# EAGLE design rc1180 (EAGLE 9.6.2)
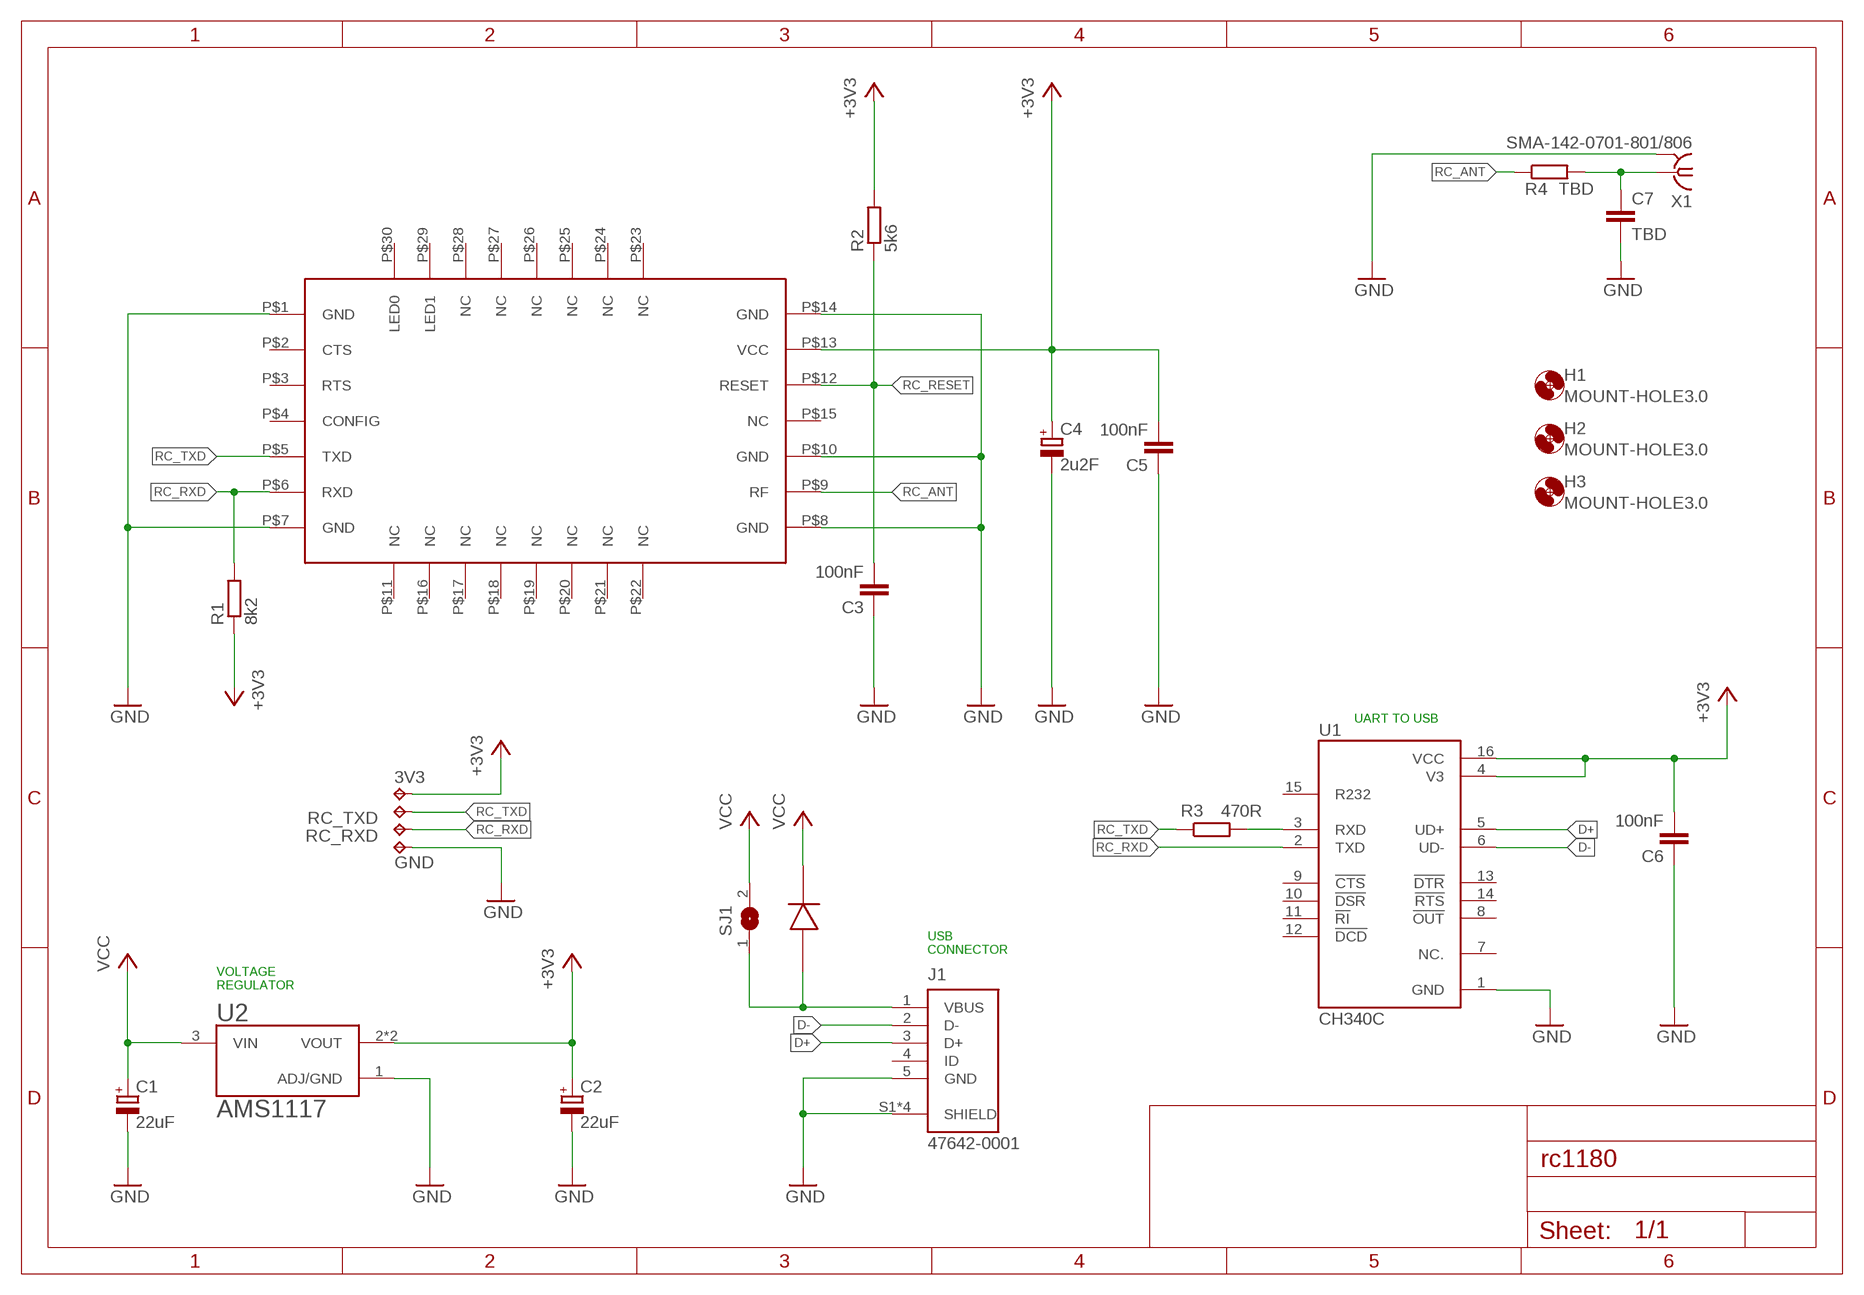
[diagram p0: schematic, sheet 1]

## Parts
3V3  TPB1,27  [B1,27]
C1  22uF  CPOL-EUC/6032-28R  [C/6032-28R]
C2  22uF  CPOL-EUC/6032-28R  [C/6032-28R]
C3  100nF  C-EUC0805K  [C0805K]
C4  2u2F  CPOL-EUA/3216-18W  [A/3216-18W]
C5  100nF  C-EUC0805K  [C0805K]
C6  100nF  C-EUC0805K  [C0805K]
C7  TBD  C-EUC0603  [C0603]
GND  TPB1,27  [B1,27]
H1  MOUNT-HOLE3.0  [3,0]
H2  MOUNT-HOLE3.0  [3,0]
H3  MOUNT-HOLE3.0  [3,0]
J1  47642-0001  [MOLEX_47642-0001]
R1  8k2  R-EU_R0805  [R0805]
R2  5k6  R-EU_R0805  [R0805]
R3  470R  R-EU_R0805  [R0805]
R4  TBD  R-EU_R0603  [R0603]
RC_RXD  TPB1,27  [B1,27]
RC_TXD  TPB1,27  [B1,27]
SJ1  SJ  [SJ]
U1  CH340C  [SOIC127P600X180-16N]
U2  AMS1117  [SOT229P700X180-4N]
U$1  RC1180-MBUS3  [RC1180-MBUS3]
U$2  MBR0540  [SOD123]
X1  SMA-142-0701-801/806  [J502-ND-142-0701-801/806]

## Nets
+3V3: 3V3.TP C2.+ C4.+ C5.2 C6.2 R1.1 R2.2 U1.4(V3) U1.16(VCC) U2.2(VOUT) U2.4(VOUT) U$1.P$13(VCC)
D+: J1.3(D+) U1.5(UD+)
D-: J1.2(D-) U1.6(UD-)
GND: C1.- C2.- C3.1 C4.- C5.1 C6.1 C7.2 GND.TP J1.5(GND) J1.S1(SHIELD) J1.S2(SHIELD) J1.S3(SHIELD) J1.S4(SHIELD) U1.1(GND) U2.1(ADJ/GND) U$1.P$1(GND) U$1.P$7(GND) U$1.P$8(GND) U$1.P$10(GND) U$1.P$14(GND) X1.G@1 X1.G@2 X1.G@3 X1.G@4
N$1: R3.2 U1.3(RXD)
N$2: J1.1(VBUS) SJ1.1 U$2.A
N$3: C7.1 R4.2 X1.1
RC_ANT: R4.1 U$1.P$9(RF)
RC_RESET: C3.2 R2.1 U$1.P$12(RESET)
RC_RXD: R1.2 RC_RXD.TP U1.2(TXD) U$1.P$6(RXD)
RC_TXD: R3.1 RC_TXD.TP U$1.P$5(TXD)
VCC: C1.+ SJ1.2 U2.3(VIN) U$2.C(K)
Unconnected: J1.4(ID) U1.7(NC.) U1.8(!OUT) U1.9(!CTS) U1.10(!DSR) U1.11(!RI) U1.12(!DCD) U1.13(!DTR) U1.14(!RTS) U1.15(R232) U$1.P$2(CTS) U$1.P$3(RTS) U$1.P$4(CONFIG) U$1.P$11(NC) U$1.P$15(NC) U$1.P$16(NC) U$1.P$17(NC) U$1.P$18(NC) U$1.P$19(NC) U$1.P$20(NC) U$1.P$21(NC) U$1.P$22(NC) U$1.P$23(NC) U$1.P$24(NC) U$1.P$25(NC) U$1.P$26(NC) U$1.P$27(NC) U$1.P$28(NC) U$1.P$29(LED1) U$1.P$30(LED0)

## Notes on the sheet
- UART TO USB
- USB 
  CONNECTOR
- VOLTAGE
  REGULATOR

## Library data of the parts
3V3 GND RC_RXD RC_TXD = testpad:TP: Test pad
C1 C2 = rcl:CPOL-EU: POLARIZED CAPACITOR, European symbol; SPICEPREFIX: C; TME_PN: 293D226X9010C2TE3
C3 C5-C7 = rcl:C-EU: CAPACITOR, European symbol; SPICEPREFIX: C
C4 = rcl:CPOL-EU: POLARIZED CAPACITOR, European symbol; SPICEPREFIX: C; TME_PN: T491A225K020AT
H1-H3 = holes:MOUNT-HOLE: MOUNTING HOLE with drill center marker
J1 = 47642-0001:47642-0001: Micro-USB B Receptacle, Mid-Mount, with Through Hole Solder Tab, Gold (Au) Flash Plating, without Mylar, Lead-Free; AVAILABILITY: Unavailable; DESCRIPTION: USB - micro B Receptacle Connector 5 Position Board Edge, Cutout; Surface Mount, Right Angle; MF: Molex; MP: 47642-0001; PACKAGE: None; PRICE: None
R1-R4 = rcl:R-EU_: RESISTOR, European symbol; SPICEPREFIX: R
SJ1 = jumper:SJ: SMD solder JUMPER
U1 = CH340C:CH340C: USB to serial chip CH340; MANUFACTURER: WCH; MAXIMUM_PACKAGE_HEIGHT: 1.8 mm; PARTREV: 2G; STANDARD: IPC 7351B
U2 = AMS1117:AMS1117: Sot223/Pkg 1-Amp 5-Volt Low Drop Out Voltage Regulatator; MANUFACTURER: AMS; MAXIMUM_PACKAGE_HEIGHT: 1.8mm; PARTREV: N/A; STANDARD: IPC-7351B
U$1 = jacek27:RC1180-MBUS3
U$2 = MBR0540:MBR0540; TME_PN: MBR0540-TP
X1 = con-coax:SMA-: SMA 50 Ohm End Launch Jack Receptacle - Round Contact Johnson Components Source: www.johnsoncomponents.com .. J502-ND.pdf; MF: JOHNSON COMPONENTS; MPN: 142-0701-801; OC_FARNELL: 1608592; OC_NEWARK: 90F2624

## Board
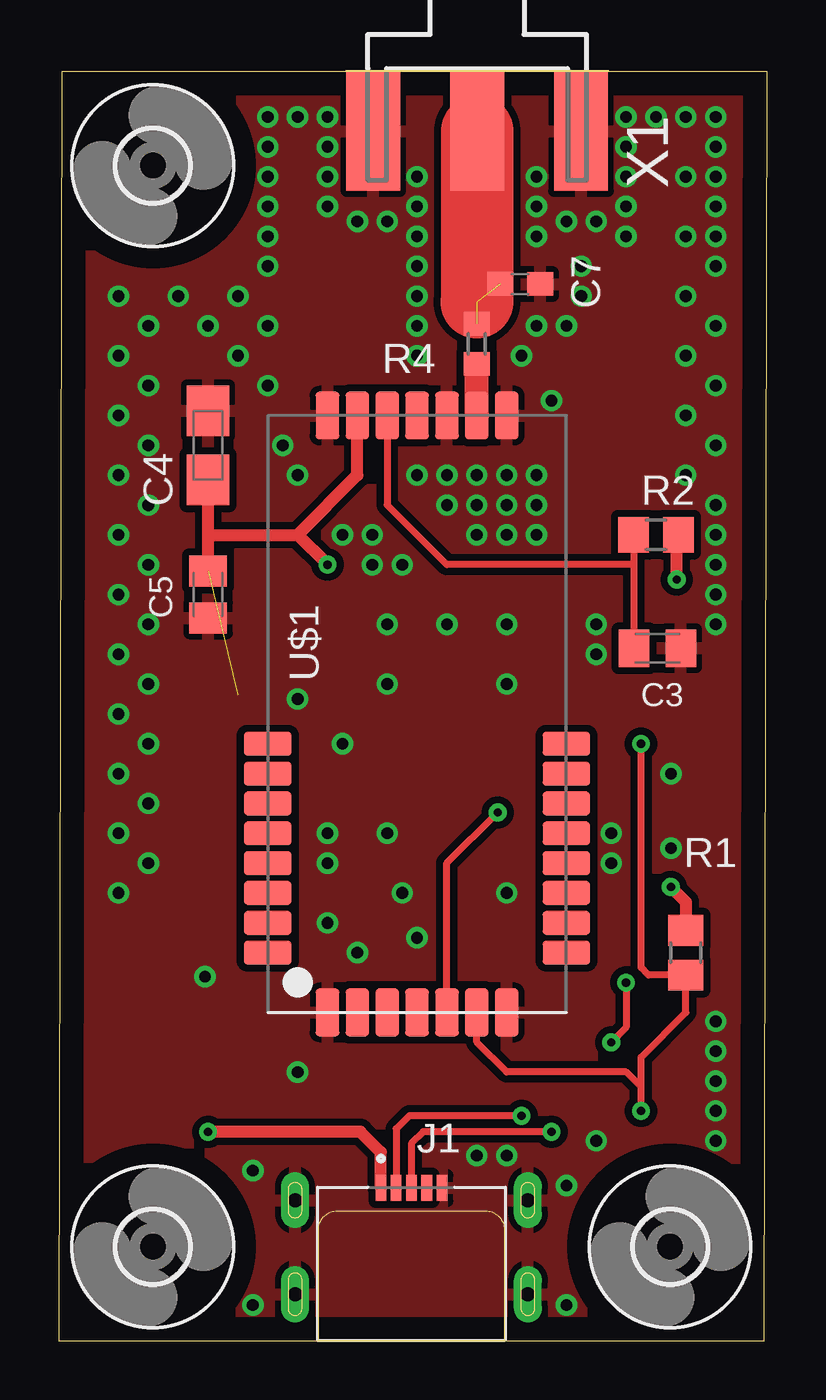
[diagram p1: board, top side]
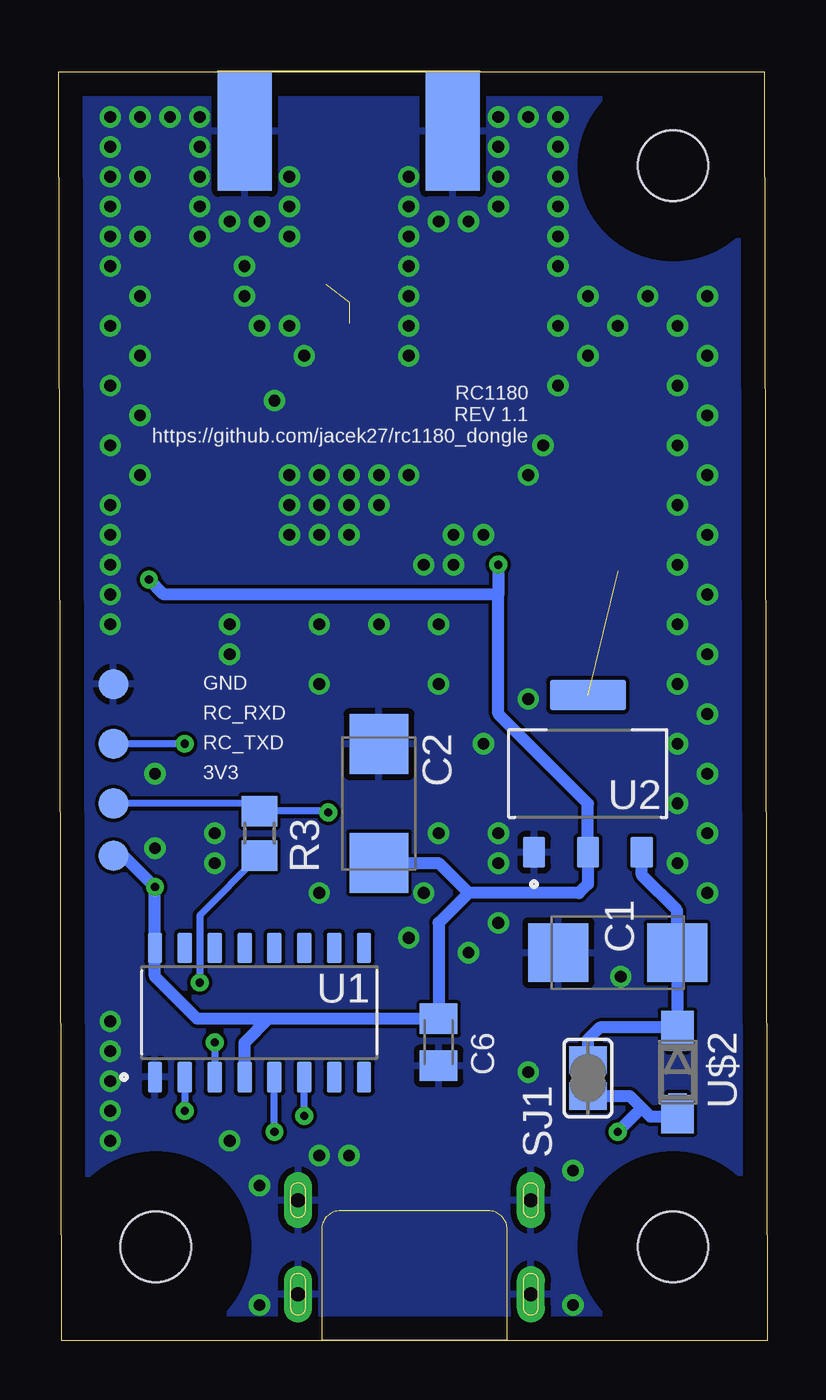
[diagram p2: board, bottom side, seen from below]

Size 30.13 x 54.03 mm. Coordinates in mm from the lower left corner, seen from the top.
Outline: 0,0 30,0 30.13,54 0.13,54 0,0
Copper layers (1*16): Top 0.035mm / dielectric 1.5mm / Bottom 0.035mm
Design rules "default": minimum track width 6mil, minimum drill 0.35mm, track to track 6mil, track to pad 6mil, pad to pad 6mil, via to via 6mil, smd to smd 6mil, copper to edge 40mil, drill to drill 6mil, minimum pad ring 10mil, minimum via ring 8mil, stop-mask expansion 4mil, vias tented up to drill 0mil, thermal gap 10mil

### Footprints (pad centres in the part's own frame; a part is rotated, then mirrored left to right if it is on the bottom)
B1,27 = smd 1.27 x 1.27: TP 0,0
C/6032-28R = smd 2.55 x 2.5: + 2.525,0; - -2.525,0
C0805K = smd 1.3 x 1.6: 1 -1,0; 2 1,0
A/3216-18W = smd 2.15 x 1.8: + 1.475,0; - -1.475,0
C0603 = smd 1.1 x 1: 1 -0.85,0; 2 0.85,0
3,0 = hole 3: 0,0
MOLEX_47642-0001 = smd 0.45 x 1.1: 1 -1.3,0; 2 -0.65,0; 3 0,0; 4 0.65,0; 5 1.3,0 | drill 0.6 pad 1.2 long: S1 -4.95,-0.52; S2 -4.95,-4.52; S3 4.95,-4.52; S4 4.95,-0.52
R0805 = smd 1.3 x 1.5: 1 -0.95,0; 2 0.95,0
R0603 = smd 1 x 1.1: 1 -0.85,0; 2 0.85,0
SJ = smd 1.168 x 1.6: 1 -0.762,0; 2 0.762,0
SOIC127P600X180-16N = smd 1.31 x 0.62: 1 -2.75,4.445; 2 -2.75,3.175; 3 -2.75,1.905; 4 -2.75,0.635; 5 -2.75,-0.635; 6 -2.75,-1.905; 7 -2.75,-3.175; 8 -2.75,-4.445; 9 2.75,-4.445; 10 2.75,-3.175; 11 2.75,-1.905; 12 2.75,-0.635; 13 2.75,0.635; 14 2.75,1.905; 15 2.75,3.175; 16 2.75,4.445
SOT229P700X180-4N = smd 1.31 x 0.93: 1 -3.345,2.29; 2 -3.345,0; 3 -3.345,-2.29 | smd 1.31 x 3.24: 4 3.345,0
RC1180-MBUS3 = smd 2.032 x 1.016: P$1 0,10.16; P$2 0,8.89; P$3 0,7.62; P$4 0,6.35; P$5 0,5.08; P$6 0,3.81; P$7 0,2.54; P$8 25.4,2.54; P$9 25.4,3.81; P$10 25.4,5.08; P$11 25.4,6.35; P$12 25.4,7.62; P$13 25.4,8.89; P$14 25.4,10.16 | smd 1.016 x 2.032: P$15 2.54,0; P$16 3.81,0; P$17 5.08,0; P$18 6.35,0; P$19 7.62,0; P$20 8.89,0; P$21 10.16,0; P$22 11.43,0; P$23 11.43,12.7; P$24 10.16,12.7; P$25 8.89,12.7; P$26 7.62,12.7; P$27 6.35,12.7; P$28 5.08,12.7; P$29 3.81,12.7; P$30 2.54,12.7
SOD123 = smd 1.6 x 0.8: 1 -1.7,0; 2 1.7,0 | smd 1.4 x 1.4: A 1.9,0; C -1.9,0
J502-ND-142-0701-801/806 = smd 5.08 x 2.286: 1 2.565,0; G@1 2.565,4.42; G@2 2.565,-4.42 | smd 5.08 x 2.286 bottom: G@3 2.565,4.42; G@4 2.565,-4.42

### Placement (x,y rotation side)
3V3  27.8,20.64 0 bottom
C1  6.35,16.51 0 bottom
C2  16.51,22.86 270 bottom
C3  25.46,29.46 180 top
C4  6.35,38.1 270 top
C5  6.35,31.75 90 top
C6  13.97,12.7 90 bottom
C7  19.62,44.96 0 top
GND  27.8,27.94 0 bottom
H1  26,4 0 top
H2  4,4 0 top
H3  4,50 0 top
J1  15,6.5 0 top
R1  26.67,16.51 270 top
R2  25.4,34.29 0 top
R3  21.59,21.59 270 bottom
R4  17.78,42.42 90 top
RC_RXD  27.8,25.4 0 bottom
RC_TXD  27.8,22.86 0 bottom
SJ1  7.62,11.18 90 bottom
U1  21.59,13.97 90 bottom
U2  7.62,24.13 90 bottom
U$1  21.59,13.97 90 top
U$2  3.81,11.43 270 bottom
X1  17.79,54.03 270 top

### Tracks (layer width: path | path; a pad name or v marks a point on that pad's centre or on a via)
+3V3  (via drill 0.35)  (1 unrouted)
  Top 0.508: C5.2 6.35,34.29 | 6.35,34.29 C4.+ | 10.16,34.29 12.7,36.83 U$1.P$13 | 6.35,34.29 10.16,34.29 | v11.43,33.02 10.16,34.29 | v26.29,32.38 26.29,34.23 R2.2 | v26.04,19.3 26.67,18.67 R1.1
  Bottom 0.508: 21.21,13.7 C6.2 13.97,17.78 12.7,19.05 | 21.21,13.7 24.24,13.7 26.04,15.49 U1.16 v26.04,19.3 27.37,20.64 3V3.TP | U1.4 22.23,12.68 21.21,13.7 | 12.7,19.05 8,19.05 7.62,19.43 U2.2 7.62,22.86 11.43,26.67 11.43,31.75 | C2.+ 16.5,20.32 13.97,20.32 12.7,19.05 | v11.43,33.02 11.43,31.75 | 11.43,31.75 25.65,31.75 v26.29,32.38
D+  (via drill 0.35)
  Top 0.305: v20.95,8.89 15.49,8.89 15,8.4 J1.3
  Bottom 0.305: v20.95,8.89 U1.5
D-  (via drill 0.35)
  Top 0.305: v19.68,9.57 14.91,9.57 14.35,9.02 J1.2
  Bottom 0.305: v19.68,9.57 U1.6
GND  (via drill 0.5)
  other vias: 13.97,27.94 19.05,27.94 2.54,24.13 2.54,26.67 2.54,29.21 2.54,31.75 2.54,21.59 2.54,19.05 10.16,11.43 6.22,15.49 22.86,8.51 27.94,8.51 27.94,9.78 27.94,11.05 27.94,12.32 27.94,13.59 16.51,30.48 13.97,30.48 19.05,30.48 27.94,30.48 27.94,31.75 27.94,33.02 27.94,34.29 27.94,35.56 8.89,48.26 8.89,46.99 8.89,45.72 8.89,43.18 10.16,36.83 8.89,40.64 20.32,36.83 20.32,35.56 17.78,36.83 17.78,35.56 19.05,34.29 19.05,19.05 8.89,49.53 10.16,52.07 11.43,50.8 12.7,47.62 15.24,48.26 15.24,46.99 15.24,45.72 15.24,44.45 15.24,43.18 15.24,41.91 20.32,48.26 20.32,46.99 20.32,49.53 15.24,49.53 13.97,47.62 11.43,48.26 11.43,49.53 11.43,52.07 8.89,52.07 8.89,50.8 21.59,47.62 22.86,47.62 24.13,46.99 24.13,48.26 24.13,49.53 24.13,50.8 24.13,52.07 25.4,52.07 26.67,52.07 27.94,52.07 27.94,50.8 27.94,49.53 27.94,48.26 27.94,46.99 20.32,43.18 21.59,43.18 22.23,44.45 22.23,45.72 19.68,41.91 20.95,40.01 27.94,45.72 27.94,43.18 27.94,40.64 27.94,38.1 26.04,20.95 26.04,24.13 23.5,21.59 22.86,29.21 22.86,30.48 23.5,20.32 21.59,1.52 8.26,1.52 8.26,7.24 17.78,7.87 19.05,7.87 21.59,6.6 11.43,20.32 13.97,21.59 12.7,16.51 11.43,17.78 14.61,19.05 15.24,17.14 11.43,21.59 12.06,25.4 10.16,27.3 16.51,36.83 19.05,36.83 16.51,35.56 19.05,35.56 17.78,34.29 20.32,34.29 15.24,36.83 9.53,38.1 12.06,34.29 13.34,34.29 13.34,33.02 14.61,33.02 2.54,34.29 2.54,36.83 2.54,39.37 2.54,41.91 2.54,44.45 5.08,44.45 7.62,44.45 3.81,40.64 3.81,38.1 3.81,35.56 3.81,33.02 3.81,30.48 3.81,27.94 3.81,25.4 3.81,22.86 3.81,20.32 3.81,43.18 6.35,43.18 7.62,41.91 26.67,49.53 26.67,46.99 26.67,44.45 26.67,41.91 26.67,39.37 26.67,36.83
  pour Bottom: 0,0 0,55.88 31.75,55.88 31.75,0
  pour Top (isolate 0.305): 0,0 0,54.61 30.48,54.61 30.48,0
N$1  (via drill 0.35)
  Top 0.305: v24.13,15.24 24.13,13.34 v23.5,12.7
  Bottom 0.305: R3.2 24.13,18.1 v24.13,15.24 | v23.5,12.7 U1.3
N$2  (via drill 0.35)
  Top 0.508: v6.35,8.89 12.83,8.89 13.7,8.02 J1.1
  Bottom 0.508: U$2.A 4.96,9.53 5.33,9.91 | SJ1.1 5.84,10.41 5.33,9.91 | v6.35,8.89 5.33,9.91
N$3  (2 unrouted)
  Top 3.08: X1.1 17.79,44.21 17.78,44.2
RC_ANT
  Top 1.016: U$1.P$9 R4.1
RC_RESET
  Top 0.305: U$1.P$12 13.97,35.56 16.51,33.02 24.45,33.02 | R2.1 24.45,33.02 | 24.45,33.02 24.45,29.48 C3.2
RC_RXD  (via drill 0.35)
  Top 0.305: U$1.P$6 17.78,12.7 19.05,11.43 24.13,11.43 24.77,10.79 | v24.77,9.78 24.77,10.79 | 24.77,10.79 24.77,12.06 26.67,13.97 R1.2 25.08,15.56 24.77,15.88 v24.77,25.4
  Bottom 0.305: U1.2 v24.77,9.78 | v24.77,25.4 RC_RXD.TP
RC_TXD  (via drill 0.35)
  Top 0.305: U$1.P$5 16.51,20.32 v18.67,22.48
  Bottom 0.305: v18.67,22.48 18.73,22.54 R3.1 21.91,22.86 RC_TXD.TP
VCC
  Bottom 0.508: SJ1.2 7.62,12.83 7.12,13.33 U$2.C 3.81,16.5 C1.+ 3.83,18.3 5.33,19.81 U2.3

### Text on the board
bNames: RC1180 / REV 1.1 / https://github.com/jacek27/rc1180_dongle